# Altium project Board4.PrjPcb
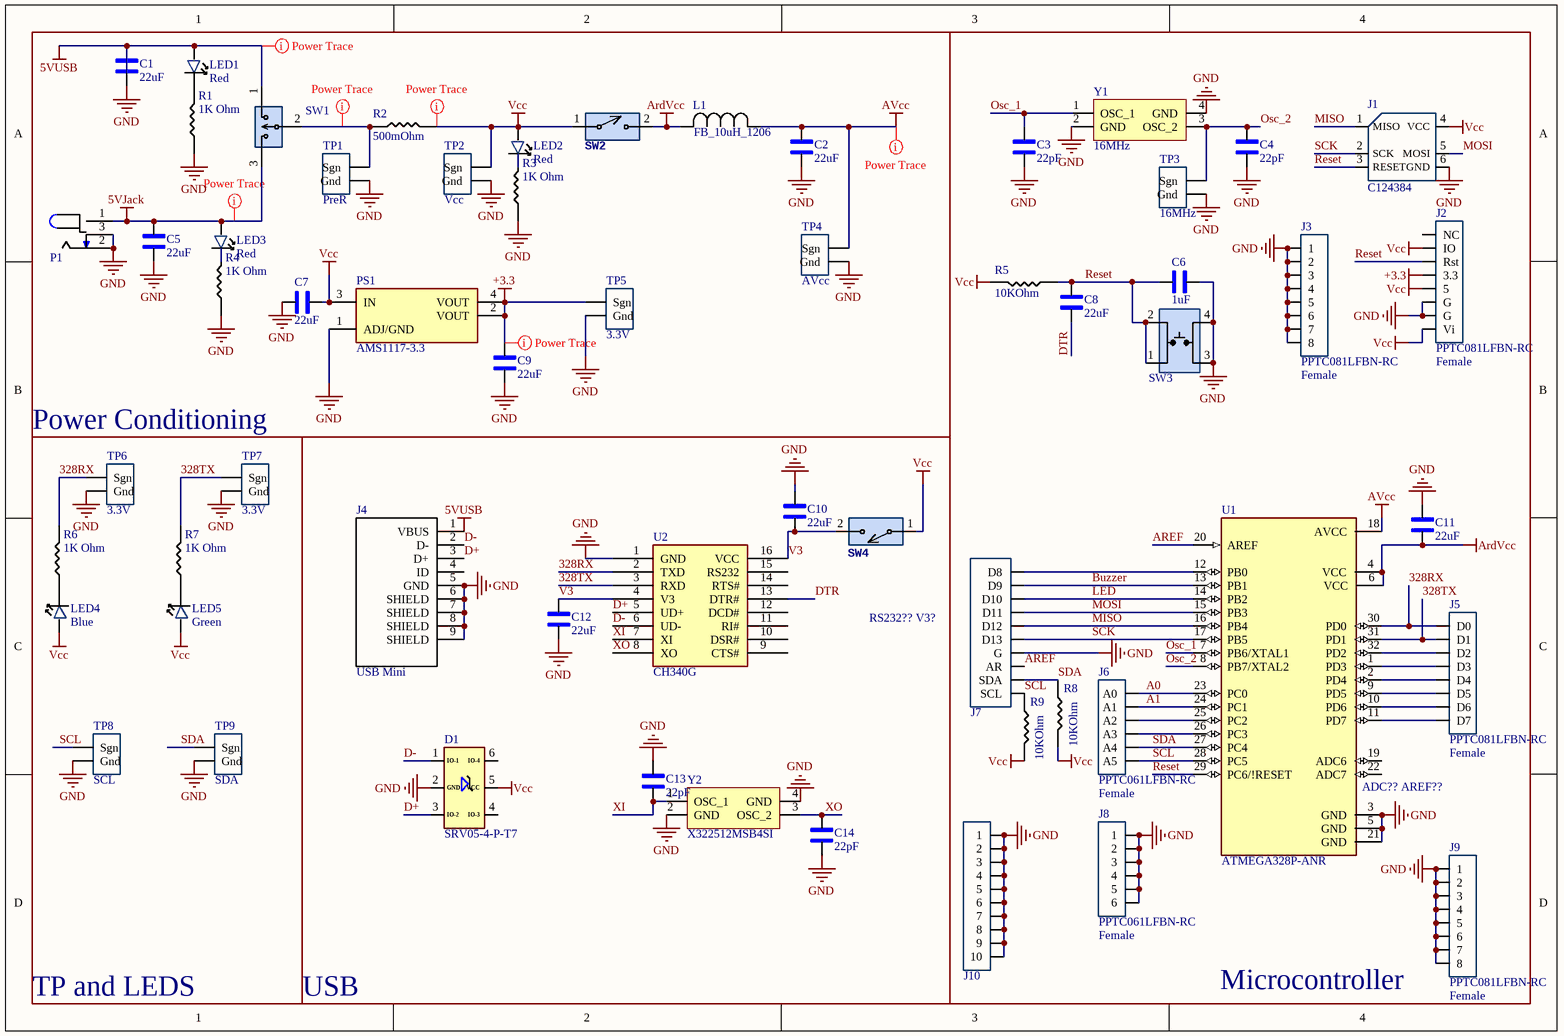
[diagram p0: Board4.SchDoc]
2 sheets, 103 parts. Net scope: global (net labels, ports and power ports of the same name join across sheets).
Board file: Board4.PcbDoc
Sheets:
  Board4.SchDoc
  Rth.SchDoc

## Sheet Board4.SchDoc
size A4; SheetNumber: 1; SheetTotal: 2

### Parts
C1  22uF  [1206_Passive_Capacitor]
C2  22uF  [1206_Passive_Capacitor]
C3  22pF  [1206_Passive_Capacitor]
C4  22pF  [1206_Passive_Capacitor]
C5  22uF  [1206_Passive_Capacitor]
C6  1uF  [1206_Passive_Capacitor]
C7  22uF  [1206_Passive_Capacitor]
C8  22uF  [1206_Passive_Capacitor]
C9  22uF  [1206_Passive_Capacitor]
C10  22uF  [1206_Passive_Capacitor]
C11  22uF  [1206_Passive_Capacitor]
C12  22uF  [1206_Passive_Capacitor]
C13  22pF  [1206_Passive_Capacitor]
C14  22pF  [1206_Passive_Capacitor]
D1  SRV05-4-P-T7  [TVS]
J1  LCSC Part#: C124384  [ICSP]  (hidden comment: NRPN032PAEN-RC)
J2  PPTC081LFBN-RC  value Female  [8_PIN_ARD-PWR_100MIL]
J3  PPTC081LFBN-RC  value Female  [8_PIN_100MIL - Female]
J4  USB Mini  [USB_MINI_B]
J5  PPTC081LFBN-RC  value Female  [8_PIN_ARD-DIG_100MIL]
J6  PPTC061LFBN-RC  value Female  [6_PIN_ARD-Analog_100mil]
J7  PPTC101LFBN-RC  [10_PIN_ARDUINO_100MIL]  (value not drawn)
J8  PPTC061LFBN-RC  value Female  [6_PIN_100MIL -Female]
J9  PPTC081LFBN-RC  value Female  [8_PIN_100MIL - Female]
J10  PPTC101LFBN-RC  [10_PIN_100MIL - Female]  (value not drawn)
L1  FB_10uH_1206  [AIML-1206_ABR-M]
LED1  Red  [LED_1206]
LED2  Red  [LED_1206]
LED3  Red  [LED_1206]
LED4  Blue  [LED_1206]
LED5  Green  [LED_1206]
P1  Power Jack  [Power_Jack]  (value not drawn)
PS1  AMS1117-3.3  [LDO]
R1  value 1K Ohm  [1206_Passive_Resitor]  (hidden comment: 1k)
R2  value 500mOhm  [1206_Passive_Resitor]  (hidden comment: 500m)
R3  value 1K Ohm  [1206_Passive_Resitor]  (hidden comment: 1k)
R4  value 1K Ohm  [1206_Passive_Resitor]  (hidden comment: 1k)
R5  value 10KOhm  [1206_Passive_Resitor]  (hidden comment: 10k)
R6  value 1K Ohm  [1206_Passive_Resitor]  (hidden comment: 1k)
R7  value 1K Ohm  [1206_Passive_Resitor]  (hidden comment: 1k)
R8  value 10KOhm  [1206_Passive_Resitor]  (hidden comment: 10k)
R9  value 10KOhm  [1206_Passive_Resitor]  (hidden comment: 10k)
SW1  PREC003SAAN-RC  [3_PIN_100mil]  (value not drawn)
SW2  SW_2Pin_100mil_Switch  [2Pin-Header-Conn]  (value not drawn)
SW3  TL3305AF160QG  [Switch_JLC]  (value not drawn)
SW4  SW_2Pin_100mil_Switch  [2Pin-Header-Conn]  (value not drawn)
TP1  PreR  [TP10x_Probe]
TP2  Vcc  [TP10x_Probe]
TP3  16MHz  [TP10x_Probe]
TP4  AVcc  [TP10x_Probe]
TP5  3.3V  [TP10x_Probe]
TP6  3.3V  [TP10x_Probe]
TP7  3.3V  [TP10x_Probe]
TP8  SCL  [TP10x_Probe]
TP9  SDA  [TP10x_Probe]
U1  ATMEGA328P-ANR  [ATMega328P]
U2  CH340G  [USB to serial]
Y1  value 16MHz  [Crystal resonator]  (hidden comment: X322516MLB4SI)
Y2  X322512MSB4SI  [Crystal resonator]

### Blocks framed on the sheet
Power Conditioning: C1 C2 C5 C7 C9 L1 LED1-LED3 P1 PS1 R1-R4 SW1 SW2 TP1 TP2 TP4 TP5
Microcontroller: C3 C4 C6 C8 C11 J1-J3 J5-J10 R5 R8 R9 SW3 TP3 U1 Y1
TP and LEDS: LED4 LED5 R6 R7 TP6-TP9
USB: C10 C12-C14 D1 J4 SW4 U2 Y2

### Nets
5VJack: C5.2 LED3.1 P1.1 SW1.3
5VUSB: C1.1 J4.1(VBUS) LED1.1 SW1.1
+3.3: C9.2 J2.4(3.3) PS1.2(VOUT) PS1.4(VOUT) TP5.1(Sgn)
ArdVcc: C11.2 L1.2 SW2.2 U1.4(VCC) U1.6(VCC)
AVcc: C2.2 L1.1 TP4.1(Sgn) U1.18(AVCC)
GND: C1.2 C2.1 C3.1 C4.1 C5.1 C6.1 C7.1 C9.1 C10.1 C11.1 C12.1 C13.2 C14.1 D1.2(GND) J1.6(GND) J2.6(G) J2.7(G) J3.1 J3.2 J3.3 J3.4 J3.5 J3.6 J3.7 J3.8 J4.5(GND) J4.6(SHIELD) J4.7(SHIELD) J4.8(SHIELD) J4.9(SHIELD) J7.4(G) J8.1 J8.2 J8.3 J8.4 J8.5 J8.6 J9.1 J9.2 J9.3 J9.4 J9.5 J9.6 J9.7 J9.8 J10.1 J10.2 J10.3 J10.4 J10.5 J10.6 J10.7 J10.8 J10.9 J10.10 P1.2 P1.3 PS1.1(ADJ/GND) R1.1 R3.1 R4.1 SW3.3 SW3.4 TP1.2(Gnd) TP2.2(Gnd) TP3.2(Gnd) TP4.2(Gnd) TP5.2(Gnd) TP6.2(Gnd) TP7.2(Gnd) TP8.2(Gnd) TP9.2(Gnd) U1.3(GND) U1.5(GND) U1.21(GND) U2.1(GND) Y1.2(GND) Y1.4(GND) Y2.2(GND) Y2.4(GND)
Vcc: C7.2 D1.5(VCC) J1.4(VCC) J2.2(IO) J2.5 J2.8(Vi) LED2.1 LED4.1 LED5.1 PS1.3(IN) R2.2 R5.2 R8.2 R9.2 SW2.1 SW4.1 TP2.1(Sgn)
328RX: J5.8(D0) R6.2 TP6.1(Sgn) U1.30(PD0) U2.2(TXD)
328TX: J5.7(D1) R7.2 TP7.1(Sgn) U1.31(PD1) U2.3(RXD)
A0: J6.1(A0) U1.23(PC0)
A1: J6.2(A1) U1.24(PC1)
AREF: J7.3(AR) U1.20(AREF)
Buzzer: J7.9(D9) U1.13(PB1)
D+: D1.3(IO-2) J4.3(D+) U2.5(UD+)
D-: D1.1(IO-1) J4.2(D-) U2.6(UD-)
DTR: C8.2 U2.13(DTR#)
LED: J7.8(D10) U1.14(PB2)
MISO: J1.1(MISO) J7.6(D12) U1.16(PB4)
MOSI: J1.5(MOSI) J7.7(D11) U1.15(PB3)
Osc_1: C3.2 U1.7(PB6/XTAL1) Y1.1(OSC_1)
Osc_2: C4.2 TP3.1(Sgn) U1.8(PB7/XTAL2) Y1.3(OSC_2)
Reset: C6.2 C8.1 J1.3(RESET) J2.3(Rst) R5.1 SW3.1 SW3.2 U1.29(PC6/!RESET)
SCK: J1.2(SCK) J7.5(D13) U1.17(PB5)
SCL: J6.6(A5) J7.1(SCL) R9.1 TP8.1(Sgn) U1.28(PC5)
SDA: J6.5(A4) J7.2(SDA) R8.1 TP9.1(Sgn) U1.27(PC4)
V3: C10.2 C12.2 SW4.2 U2.4(V3) U2.16(VCC)
XI: C13.1 U2.7(XI) Y2.1(OSC_1)
XO: C14.2 U2.8(XO) Y2.3(OSC_2)
NetJ5_1: J5.1(D7) U1.11(PD7)
NetJ5_2: J5.2(D6) U1.10(PD6)
NetJ5_3: J5.3(D5) U1.9(PD5)
NetJ5_4: J5.4(D4) U1.2(PD4)
NetJ5_5: J5.5(D3) U1.1(PD3)
NetJ5_6: J5.6(D2) U1.32(PD2)
NetJ6_3: J6.3(A2) U1.25(PC2)
NetJ6_4: J6.4(A3) U1.26(PC3)
NetJ7_10: J7.10(D8) U1.12(PB0)
NetLED1_2: LED1.2 R1.2
NetLED2_2: LED2.2 R3.2
NetLED3_2: LED3.2 R4.2
NetLED4_2: LED4.2 R6.1
NetLED5_2: LED5.2 R7.1
NetR2_1: R2.1 SW1.2 TP1.1(Sgn)

Not connected (* = marked no-connect by the designer): D1 4(IO-3) 6(IO-4); J2 1(NC); J4 4(ID); U1 19(ADC6) 22(ADC7); U2 9(CTS#) 10(DSR#) 11(RI#) 12(DCD#) 14(RTS#) 15(RS232)

### Layout directives
rule Width Constraint [Pref Width = 20mil    Min Width = 10mil    Max Width = 100mil]: 5VJack, 5VUSB, +3.3, AVcc, NetR2_1, Vcc

### Notes on the sheet
- RS232?? V3?
- (near U1) ADC?? AREF??

### Library data of the parts
C1 C2 C5 C7-C12 = C_22uF_1206: 22uF ±10% 25V X5R 1206 Multilayer Ceramic Capacitors MLCC - SMD/SMT RoHS; MFR Part #: CL31A226KAHNNNE; Type: basic; LCSC Part#: C12891; Datasheet: https://datasheet.lcsc.com/lcsc/1811031514_Samsung-Electro-Mechanics-CL31A226KAHNNNE_C12891.pdf; Value: 22uF
C3 C4 C13 C14 = C_22pF_1206: 22pF ±5% 1kV C0G 1206 Multilayer Ceramic Capacitors MLCC - SMD/SMT RoHS; MFR Part #: 1206CG220J102NT; Type: Extended; LCSC Part#: C313096; Datasheet: https://datasheet.lcsc.com/lcsc/1810311150_FH-Guangdong-Fenghua-Advanced-Tech-1206CG220J102NT_C313096.pdf; Value: 22pF
C6 = C_1uF_1206: MULTILAYER CERAMIC CAPACITORS MLCC - SMD/SMT 1UF 50V 1206 ROHS; MFR Part #: CL31B105KBHNNNE; Type: Basic; Digikey Link: https://www.digikey.com/product-detail/en/C1206C105M4RACTU/399-8150-1-ND/3471873/?itemSeq=304982366; LCSC Part#: C1848; Value: 1uF
D1 = D_TVS_Diode: TVS SOT-23-6 ROHS; Value: TVS DIODE 5.5V 6TSOP; Type: Basic; MFR Part #: SRV05-4-P-T7; LCSC Part#: C85364; Datasheet: https://datasheet.lcsc.com/szlcsc/ProTek-Devices-SRV05-4-P-T7_C85364.pdf
J1 = J_ICSP: Connector Header Through Hole 6 position 0.079" (2.00mm); Digikey Link: https://www.digikey.com/product-detail/en/NRPN032PAEN-RC/S5801-03-ND/804955/?itemSeq=304982355; MFR Part #: NRPN032PAEN-RC; Type: Extended
J2 = JF_8_PIN_FEMALE_ARD-Pwr: 8 Position Header Connector 0.100" (2.54mm) Through Hole Tin; Digikey Link: https://www.digikey.com/product-detail/en/PPTC081LFBN-RC/S7006-ND/810147/?itemSeq=304982354; MFR Part #: PPTC081LFBN-RC; Type: Extended; LCSC Part#: C27438
J3 J9 = JF_8_PIN_FEMALE: 8 Position Header Connector 0.100" (2.54mm) Through Hole Tin; Digikey Link: https://www.digikey.com/product-detail/en/PPTC081LFBN-RC/S7006-ND/810147/?itemSeq=304982354; MFR Part #: PPTC081LFBN-RC; Type: Extended; LCSC Part#: C27438
J4 = J_USB_B_Mini: Through Hole USB Connectors RoHS; MFR Part #: 920-462A2021D10102; Value: USB mini B; LCSC Part#: C46398; Datasheet: https://datasheet.lcsc.com/szlcsc/2103081233_Jing-Extension-of-the-Electronic-Co-920-462A2021D10102_C46398.pdf; Type: Extended
J5 = JF_8_PIN_FEMALE_ARD-Dig: 8 Position Header Connector 0.100" (2.54mm) Through Hole Tin; Digikey Link: https://www.digikey.com/product-detail/en/PPTC081LFBN-RC/S7006-ND/810147/?itemSeq=304982354; MFR Part #: PPTC081LFBN-RC; Type: Extended; LCSC Part#: C27438
J6 = JF_6_PIN_FEMALE_ARD-Anolog: 6 Position Header Connector 0.100" (2.54mm) Through Hole Tin; Digikey Link: https://www.digikey.com/product-detail/en/PPTC061LFBN-RC/S7004-ND/810145/?itemSeq=304982353; MFR Part #: PPTC061LFBN-RC; LCSC Part#: C40877; Type: Extended
J7 = JF_10_PIN_FEMALE_ARDUINO: 10 Position Header Connector 0.100" (2.54mm) Through Hole Tin; Value: Female; Digikey Link: https://www.digikey.com/product-detail/en/PPTC101LFBN-RC/S7008-ND/810149/?itemSeq=304982352; MFR Part #: PPTC101LFBN-RC; LCSC Part#: C225507; Type: Extended
J8 = JF_6_PIN_FEMALE: 6 Position Header Connector 0.100" (2.54mm) Through Hole Tin; Digikey Link: https://www.digikey.com/product-detail/en/PPTC061LFBN-RC/S7004-ND/810145/?itemSeq=304982353; MFR Part #: PPTC061LFBN-RC; LCSC Part#: C40877; Type: Extended
J10 = JF_10_PIN_FEMALE_: 10 Position Header Connector 0.100" (2.54mm) Through Hole Tin; Value: Female; Digikey Link: https://www.digikey.com/product-detail/en/PPTC101LFBN-RC/S7008-ND/810149/?itemSeq=304982352; MFR Part #: PPTC101LFBN-RC; LCSC Part#: C225507; Type: Extended
L1 = FB_10uH_1206: 25mA 10uH ±10% 800mΩ 1206  Inductors (SMD) ROHS; Mfr_Name: FH (Guangdong Fenghua Advanced Tech); MFR PART #: CMI321609X100KT; Type: Basic; LCSC PART#: C1051; DataSheet: https://datasheet.lcsc.com/lcsc/1810311314_FH--Guangdong-Fenghua-Advanced-Tech-CMI321609X100KT_C1051.pdf
LED1-LED3 = LED_RED_1206: Red 621~631nm 1206 Light Emitting Diodes (LED) RoHS; MFR Part #: 15-21/R6C-FQ1R1B/2T; Type: Extended; LCSC Part#: C93133; Datasheet: https://datasheet.lcsc.com/szlcsc/1811151241_Everlight-Elec-15-21-R6C-FQ1R1B-2T_C93133.pdf; Value: Red
LED4 = LED_BLUE_1206: blue 1206  Light Emitting Diodes (LED) ROHS; MFR Part #: NCD1206B1; Type: Extended; LCSC Part#: C130717; Datasheet: https://datasheet.lcsc.com/lcsc/2008201033_Foshan-NationStar-Optoelectronics-NCD1206B1_C130717.pdf; Value: Blue
LED5 = LED_GREEN_1206: Green 513~528nm 1206 Light Emitting Diodes (LED) RoHS; MFR Part #: SZYY1206G; Type: Extended; LCSC Part#: C434439; Datasheet: https://datasheet.lcsc.com/lcsc/2006301532_Yongyu-Photoelectric-SZYY1206G_C434439.pdf; Value: Green
P1 = P_Power Jack: Power Barrel Connector Jack 2.10mm ID (0.083"), 5.50mm OD (0.217") Through Hole, Right Angle; MFR Part #: PJ-102A; Value: CONN PWR JACK 2X5.5MM SOLDER; Digikey Link: https://www.digikey.com/product-detail/en/PJ-102A/CP-102A-ND/275425/?itemSeq=304982367; LCSC Part#: C136744; Type: Extended
PS1 = PS_AMS_LDO_3v3: LOW DROPOUT REGULATORS(LDO) POSITIVE FIXED 1.3V @ 800MA 15V 3.3V 1A SOT-223 ROHS; Value: IC REG LINEAR 3.3V 800MA SOT223; MFR Part #: AMS1117-3.3; LCSC Part#: C6186; Type: Basic
R1 R3 R4 R6 R7 = R_1K_1206: CHIP RESISTOR - SURFACE MOUNT 1KOHMS ±1% 1/4W 1206 ROHS; MFR Part #: RNCP1206FTD1K00CT; Digikey Link: https://www.digikey.com/product-detail/en/RNCP1206FTD1K00/RNCP1206FTD1K00CT-ND/2240675/?itemSeq=304982373; LCSC Part#: C4410; Type: Basic
R2 = R_500mOhm_1206: Resistors/Shunt 250mW 500mΩ ±800ppm/℃ ±5% 1206  Current Sense  Resistors ROHS; MFR Part #: 1206W4J050KT5E; Datasheet: https://datasheet.lcsc.com/lcsc/1810301438_UNI-ROYAL-Uniroyal-Elec-1206W4J050KT5E_C247433.pdf; LCSC Part#: C247433; Type: Extended
R5 R8 R9 = R_10KOhm_1206: 10 kOhms ±5% 0.25W, 1/4W Chip Resistor 1206 (3216 Metric) Automotive AEC-Q200 Thick Film; MFR Part #: RMCF1206FT10K0; Digikey Link: https://www.digikey.com/en/products/detail/stackpole-electronics-inc/RMCF1206FT10K0/1759669; LCSC Part#: C17902; Type: Basic
SW1 = SW_3Pin_100mil_Switch: Connector Header Through Hole 3 position 0.100" (2.54mm); Value: CONN HEADER VERT 3POS 2.54MM; Digikey Link: https://www.digikey.com/product-detail/en/PREC003SAAN-RC/S1012EC-03-ND/2774851/?itemSeq=304982371; MFR Part #: PREC003SAAN-RC; Type: Extended; LCSC Part#: C49257
SW2 SW4 = SW_2Pin_100mil_Switch: 2Pin Header; LCSC Part#: C124375; Type: Extended
SW3 = SW_Push_Button_JLC: Tactile Switch SPST-NO Top Actuated Surface Mount; MFR Part #: KH-4.5X4.5X4.3H-STM; LCSC Part#: C2837550; Type: Extended; DataSheet: https://datasheet.lcsc.com/lcsc/2106081532_Shenzhen-Kinghelm-Elec-KH-4.5X4.5X4.3H-STM_C2837550.pdf
TP1-TP9 = TP_10x_Probe: Test Point 300 mil centers
U1 = U_ATMega328P: AVR AVR® ATmega Microcontroller IC 8-Bit 20MHz 32KB (16K x 16) FLASH 32-TQFP (7x7); MFR Part #: ATMEGA328P-AU; Value: IC MCU 8BIT 32KB FLASH 32TQFP; Digikey Link: https://www.digikey.com/product-detail/en/ATMEGA328P-ANR/ATMEGA328P-ANRCT-ND/2774230/?itemSeq=304982365; LCSC Part#: C14877; Type: Basic
U2 = U_USBtoSerial: Transceiver USB 2.0 2Mbps SOP-16_150mil USB ICs RoHS; Datasheet: https://datasheet.lcsc.com/lcsc/2008191806_WCH-Jiangsu-Qin-Heng-CH340G_C14267.pdf; LCSC Part#: C14267; MFR Part #: CH340G; Type: Basic; Value: USB to Serial
Y1 = X_16Mhz_Res: ±10ppm 16000000Hz -40℃~85℃ 贴片无源晶振 60Ω 9pF SMD3225-4P Crystals ROHS; LCSC Part#: C13738; MFR Part #: X322516MLB4SI; Type: Basic
Y2 = X_12MHz_Res: SMD Crystal Resonators 12MHz ±10ppm SMD-3225_4P RoHS; LCSC Part#: C9002; MFR Part #: X322512MSB4SI; Value: 12MHz; Type: Basic; Datasheet: https://datasheet.lcsc.com/szlcsc/Yangxing-Tech-X322512MSB4SI_C9002.pdf

## Sheet Rth.SchDoc
size A; SheetNumber: 2; SheetTotal: 2
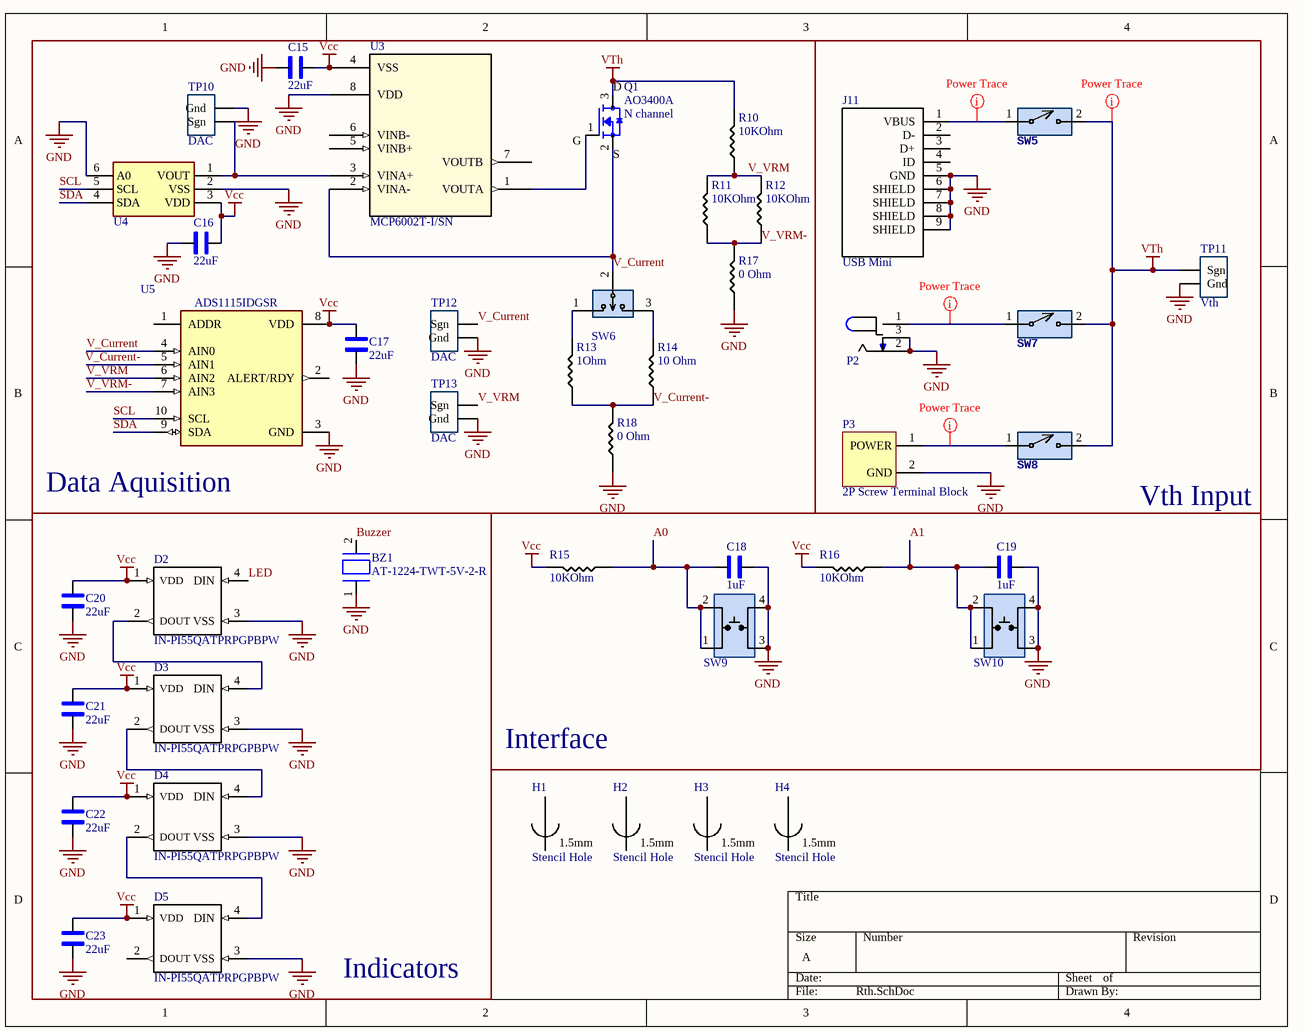
[diagram p1: Rth.SchDoc]

### Parts
BZ1  AT-1224-TWT-5V-2-R  [BUZZER- TH]
C15  22uF  [1206_Passive_Capacitor]
C16  22uF  [1206_Passive_Capacitor]
C17  22uF  [1206_Passive_Capacitor]
C18  1uF  [1206_Passive_Capacitor]
C19  1uF  [1206_Passive_Capacitor]
C20  22uF  [1206_Passive_Capacitor]
C21  22uF  [1206_Passive_Capacitor]
C22  22uF  [1206_Passive_Capacitor]
C23  22uF  [1206_Passive_Capacitor]
D2  IN-PI55QATPRPGPBPW  [SERIAL_LED - duplicate]
D3  IN-PI55QATPRPGPBPW  [SERIAL_LED - duplicate]
D4  IN-PI55QATPRPGPBPW  [SERIAL_LED - duplicate]
D5  IN-PI55QATPRPGPBPW  [SERIAL_LED - duplicate]
H1  Stencil Hole  [AlignmentHole_1.5mm]
H2  Stencil Hole  [AlignmentHole_1.5mm]
H3  Stencil Hole  [AlignmentHole_1.5mm]
H4  Stencil Hole  [AlignmentHole_1.5mm]
J11  USB Mini  [USB_MINI_B]
P2  Power Jack  [Power_Jack]  (value not drawn)
P3  2P Screw Terminal Block  [P_Terminal block 3.5mm-pitch]
Q1  AO3400A  value N channel  [N-MOSFET]
R10  value 10KOhm  [1206_Passive_Resitor]  (hidden comment: 10k)
R11  value 10KOhm  [1206_Passive_Resitor]  (hidden comment: 10k)
R12  value 10KOhm  [1206_Passive_Resitor]  (hidden comment: 10k)
R13  value 1Ohm  [1206_Passive_Resitor]  (hidden comment: 1 Ohm)
R14  10 Ohm  [1206_Passive_Resitor]
R15  value 10KOhm  [1206_Passive_Resitor]  (hidden comment: 10k)
R16  value 10KOhm  [1206_Passive_Resitor]  (hidden comment: 10k)
R17  0 Ohm  [1206_Passive_Resitor]
R18  0 Ohm  [1206_Passive_Resitor]
SW5  SW_2Pin_100mil_Switch  [2Pin-Header-Conn]  (value not drawn)
SW6  PREC003SAAN-RC  [3_PIN_100mil]  (value not drawn)
SW7  SW_2Pin_100mil_Switch  [2Pin-Header-Conn]  (value not drawn)
SW8  SW_2Pin_100mil_Switch  [2Pin-Header-Conn]  (value not drawn)
SW9  TL3305AF160QG  [Switch_JLC]  (value not drawn)
SW10  TL3305AF160QG  [Switch_JLC]  (value not drawn)
TP10  DAC  [TP10x_Probe]
TP11  Vth  [TP10x_Probe]
TP12  DAC  [TP10x_Probe]
TP13  DAC  [TP10x_Probe]
U3  MCP6002T-I/SN  [SOIC127P600X175-8N]
U4  DAC IC  [MCP4725]  (value not drawn)
U5  ADS1115IDGSR  [ADC_ADS1115IDGSR]

### Blocks framed on the sheet
Data Aquisition: C15-C17 Q1 R10-R14 R17 R18 SW6 TP10 TP12 TP13 U3-U5
Vth Input: J11 P2 P3 SW5 SW7 SW8 TP11

### Nets
GND: BZ1.1(BZ1) C15.1 C16.1 C17.1 C18.1 C19.1 C20.1 C21.1 C22.1 C23.1 D2.3(VSS) D3.3(VSS) D4.3(VSS) D5.3(VSS) J11.5(GND) J11.6(SHIELD) J11.7(SHIELD) J11.8(SHIELD) J11.9(SHIELD) P2.2 P2.3 P3.2(GND) R17.1 R18.1 SW9.3 SW9.4 SW10.3 SW10.4 TP10.2(Gnd) TP11.2(Gnd) TP12.2(Gnd) TP13.2(Gnd) U3.8(VDD) U4.2(VSS) U4.6(A0) U5.3(GND)
Vcc: C15.2 C16.2 C17.2 C20.2 C21.2 C22.2 C23.2 D2.1(VDD) D3.1(VDD) D4.1(VDD) D5.1(VDD) R15.2 R16.2 U3.4(VSS) U4.3(VDD) U5.8(VDD)
VTh: Q1.3(D) R10.2 SW5.2 SW7.2 SW8.2 TP11.1(Sgn)
A0: C18.2 R15.1 SW9.1 SW9.2
A1: C19.2 R16.1 SW10.1 SW10.2
Buzzer: BZ1.2(BZ2)
LED: D2.4(DIN)
SCL: U4.5(SCL) U5.10(SCL)
SDA: U4.4(SDA) U5.9(SDA)
V_Current: Q1.2(S) SW6.2 TP12.1(Sgn) U3.2(VINA-) U5.4(AIN0)
V_Current-: R13.1 R14.1 R18.2
V_VRM: R10.1 R11.2 R12.2 TP13.1(Sgn) U5.6(AIN2)
V_VRM-: R11.1 R12.1 R17.2 U5.7(AIN3)
NetD2_2: D2.2(DOUT) D3.4(DIN)
NetD3_2: D3.2(DOUT) D4.4(DIN)
NetD4_2: D4.2(DOUT) D5.4(DIN)
NetJ11_1: J11.1(VBUS) SW5.1
NetP2_1: P2.1 SW7.1
NetP3_1: P3.1(POWER) SW8.1
NetQ1_1: Q1.1(G) U3.1(VOUTA)
NetR13_2: R13.2 SW6.1
NetR14_2: R14.2 SW6.3
NetTP10_1: TP10.1(Sgn) U3.3(VINA+) U4.1(VOUT)

Not connected (* = marked no-connect by the designer): D5 2(DOUT); J11 2(D-) 3(D+) 4(ID); U3 5(VINB+) 6(VINB-) 7(VOUTB); U5 1(ADDR) 2(ALERT/RDY) 5(AIN1)

### Layout directives
rule Width Constraint [Pref Width = 20mil    Min Width = 10mil    Max Width = 100mil]: NetJ11_1, NetP2_1, NetP3_1, VTh

### Notes on the sheet
- Interface
- Indicators
- Labels drawn without touching a wire or pin: V_Current-
- (in symbol H_StencilAllignment_1.5mm) 1.5mm

### Library data of the parts
BZ1 = BUZZER_1: Buzzers Transducer, Externally Driven Electromechanical/Magnetic 5 V 40mA 2.4kHz 87dB @ 5V, 10cm Through Hole PC Pins; Datasheet: https://www.puiaudio.com/media/SpecSheet/AT-1224-TWT-5V-2-R.pdf; MFR Part #: AT-1224-TWT-5V-2-R
C15-C17 C20-C23 = C_22uF_1206: as C1 on sheet Board4; LCSC Part#: C12891; Datasheet: https://datasheet.lcsc.com/lcsc/1811031514_Samsung-Electro-Mechanics-CL31A226KAHNNNE_C12891.pdf; Value: 22uF
C18 C19 = C_1uF_1206: as C6 on sheet Board4; Digikey Link: https://www.digikey.com/product-detail/en/C1206C105M4RACTU/399-8150-1-ND/3471873/?itemSeq=304982366; LCSC Part#: C1848; Value: 1uF
D2-D5 = LED_Smart: LIGHT EMITTING DIODES (LED) RGB 620~630NM RED, 520~530NM GREEN, 465~475NM BLUE 600MCD@16MARED,1200MCD@16MAGREEN,300MCD@16MABLUE TOP VIEW SMD-4 ROHS; MFR Part #: IN-PI55QATPRPGPBPW-60; Manufacturer: Inolux; LCSC Part#: C2761795; DataSheet: https://datasheet.lcsc.com/lcsc/2106062036_Worldsemi-WS2812B-B-W_C2761795.pdf
H1-H4 = H_StencilAllignment_1.5mm: Stencil Allignment hole for use with 1.5mm pin
J11 = J_USB_B_Mini: as J4 on sheet Board4; LCSC Part#: C46398; Datasheet: https://datasheet.lcsc.com/szlcsc/2103081233_Jing-Extension-of-the-Electronic-Co-920-462A2021D10102_C46398.pdf; Type: Extended
P2 = P_Power Jack: as P1 on sheet Board4; Digikey Link: https://www.digikey.com/product-detail/en/PJ-102A/CP-102A-ND/275425/?itemSeq=304982367; LCSC Part#: C136744; Type: Extended
P3 = P_Terminal block: Green Straight pin 3.5mm  pitch; P=3.5mm  Screw terminal ROHS; MFR Part #: KF350-3.5-2P; Manufacturer: Cixi Kefa Elec; LCSC Part#: C474892; DataSheet: https://datasheet.lcsc.com/lcsc/2001160007_Cixi-Kefa-Elec-KF350-3-5-2P_C474892.pdf
Q1 = Q_Nch_MOSFET: MOSFET N Trench 30V 5.7A 1.5V @ 250uA 26.5 m? @ 5.7A,10V SOT-23-3L RoHS; Type: Basic; LCSC Part#: C20917; Datasheet: https://datasheet.lcsc.com/szlcsc/Alpha-Omega-Semicon-AOS-AO3400A_C20917.pdf; MFR Part #: AO3400A
R10-R12 R15 R16 = R_10KOhm_1206: as R5 on sheet Board4; Digikey Link: https://www.digikey.com/en/products/detail/stackpole-electronics-inc/RMCF1206FT10K0/1759669; LCSC Part#: C17902; Type: Basic
R13 = R_1Ohm_1206: 1Ω ±5% 0.25W ±400ppm/℃ 1206 Chip Resistor - Surface Mount RoHS; MFR Part #: 1206W4J010JT5E; LCSC Part#: C1409; Datasheet: https://datasheet.lcsc.com/lcsc/1810301410_UNI-ROYAL-Uniroyal-Elec-1206W4J010JT5E_C1409.pdf; Type: Extended
R14 = R_10Ohm_1206: CHIP RESISTOR - SURFACE MOUNT 0.1OHMS ±1% 1/4W 1206 ROHS; MFR Part #: 1206W4F100JT5E; Datasheet: https://datasheet.lcsc.com/szlcsc/Uniroyal-Elec-1206W4F100JT5E_C17903.pdf; LCSC Part#: C17903; Type: Basic; Value: 10 Ohm
R17 R18 = R_0Ohm_1206: CHIP RESISTOR - SURFACE MOUNT 0OHMS ±1% 1/4W 1206 ROHS; MFR Part #: 1206W4F0000T5E; Datasheet: https://datasheet.lcsc.com/szlcsc/Uniroyal-Elec-1206W4F0000T5E_C17888.pdf; LCSC Part#: C17888; Type: Basic; Mouser link: https://www.mouser.com/ProductDetail/Royalohm/1206W4F0000T5E?qs=e8oIoAS2J1Thbopin%252BsagQ%3D%3D; Value: 0 Ohm
SW5 SW7 SW8 = SW_2Pin_100mil_Switch: 2Pin Header; LCSC Part#: C124375; Type: Extended
SW6 = SW_3Pin_100mil_Switch: as SW1 on sheet Board4; Digikey Link: https://www.digikey.com/product-detail/en/PREC003SAAN-RC/S1012EC-03-ND/2774851/?itemSeq=304982371; MFR Part #: PREC003SAAN-RC; Type: Extended; LCSC Part#: C49257
SW9 SW10 = SW_Push_Button_JLC: as SW3 on sheet Board4; LCSC Part#: C2837550; Type: Extended; DataSheet: https://datasheet.lcsc.com/lcsc/2106081532_Shenzhen-Kinghelm-Elec-KH-4.5X4.5X4.3H-STM_C2837550.pdf
TP10-TP13 = TP_10x_Probe: Test Point 300 mil centers
U3 = U_MCP6002T-I/SN: 0.6 V/us 2 1MHz 1.8V ~ 6V 100μA General Purpose SOIC-8_150mil  Operational Amplifier ROHS; Mfr: Microchip; MFR Part #: MCP6002T-I/SN; DataSheet: https://ww1.microchip.com/downloads/en/DeviceDoc/MCP6001-1R-1U-2-4-1-MHz-Low-Power-Op-Amp-DS20001733L.pdf; LCSC Part#: C7377; Type: Basic
U4 = U_MCP4725A0T-E/CH: IC DAC 12BIT V-OUT SOT23-6; Datasheet: https://ww1.microchip.com/downloads/en/DeviceDoc/22039d.pdf; LCSC Part#: C144198; type: Extended; MFR Part #: MCP4725A0T-E/CH
U5 = U_ADC_ADS1115IDGSR: 16-Bit ADC with Integrated MUX, PGA, Comparator, Oscillator, and Reference 10-VSSOP -40 to 125; MFR Part #: ADS1115IDGSR; Package: MSOP-10 Texas Instruments; LCSC Part#: C37593; SnapEDA_Link: https://www.snapeda.com/parts/ADS1115IDGSR/Texas%20Instruments/view-part/?ref=snap; Type: Extended; DigiKey link: https://www.digikey.com/product-detail/en/texas-instruments/ADS1115IDGSR/296-38849-1-ND/5142969?utm_source=snapeda&utm_medium=aggregator&utm_campaign=symbol; Value: *

## Nets that join several sheets
GND: Board4 (80 pins), Rth (36 pins)
Vcc: Board4 (17 pins), Rth (16 pins)
A0: Board4 (J6.1 U1.23), Rth (C18.2 R15.1 SW9.1 SW9.2)
A1: Board4 (J6.2 U1.24), Rth (C19.2 R16.1 SW10.1 SW10.2)
Buzzer: Board4 (J7.9 U1.13), Rth (BZ1.2)
LED: Board4 (J7.8 U1.14), Rth (D2.4)
SCL: Board4 (5 pins), Rth (U4.5 U5.10)
SDA: Board4 (5 pins), Rth (U4.4 U5.9)